# EasyEDA schematic SCH_plantcare_moisture_module_2025-02-19.json
TITLE: Plantcare moisture module; REV: 1.0; Date: 2025-02-15; Sheet: 1/1; Drawn By: arek.stasko; Company: ArkadiuszS
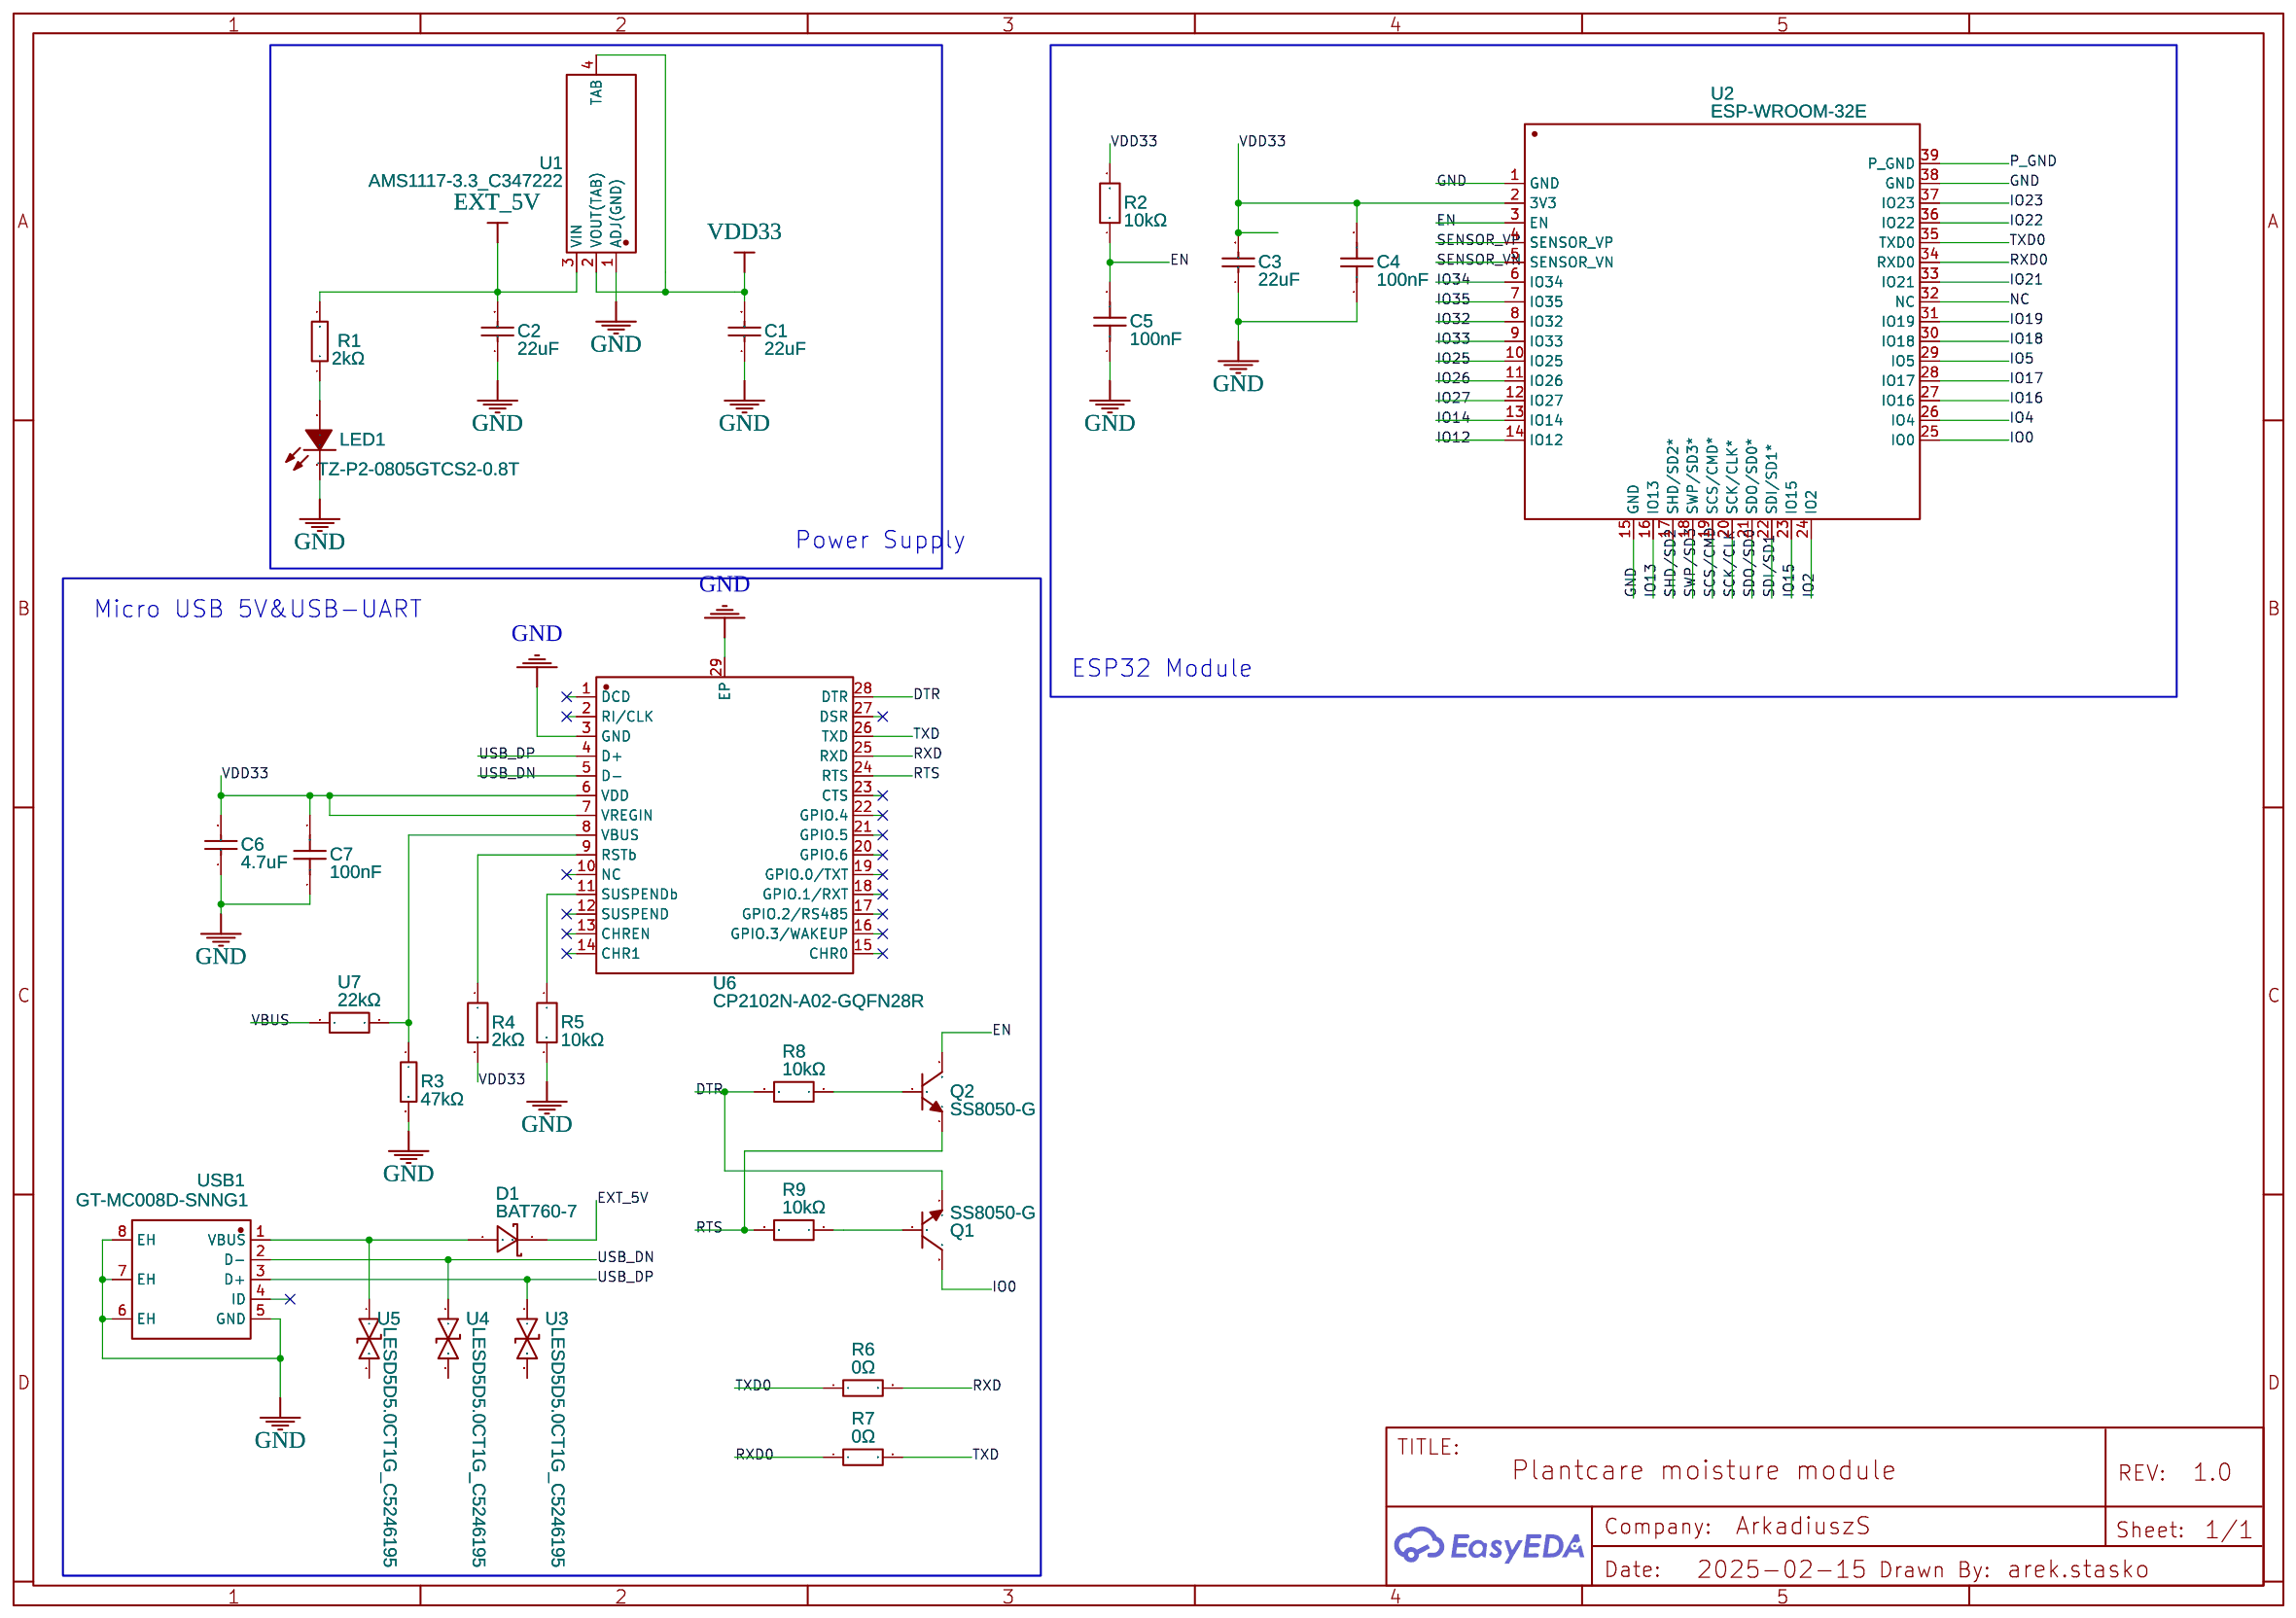
[diagram p0: schematic sheet]

## Parts
C1  22uF  [C0805]
C2  22uF  [C0805]
C3  22uF  [C0805]
C4  100nF  [C0603]
C5  100nF  [C0603]
C6  4.7uF  [C0603]
C7  100nF  [C0603]
D1  BAT760-7  [SOD-323_L1.8-W1.3-LS2.5-RD]
LED1  TZ-P2-0805GTCS2-0.8T  [LED0805-RD_GREEN]
Q1  SS8050-G  [SOT-23-3_L2.9-W1.3-P1.90-LS2.4-BR]
Q2  SS8050-G  [SOT-23-3_L2.9-W1.3-P1.90-LS2.4-BR]
R1  2kΩ  [R0603]
R2  10kΩ  [R0603]
R3  47kΩ  [R0603]
R4  2kΩ  [R0603]
R5  10kΩ  [R0603]
R6  0Ω  [R0603]
R7  0Ω  [R0603]
R8  10kΩ  [R0603]
R9  10kΩ  [R0603]
U1  AMS1117-3.3_C347222  [SOT-223-4_L6.5-W3.5-P2.30-LS7.0-BR]
U2  ESP-WROOM-32E  [COMM-SMD_ESP-WROOM-32D]
U3  LESD5D5.0CT1G_C5246195  [SOD-523_L1.2-W0.8-LS1.6-BI]
U4  LESD5D5.0CT1G_C5246195  [SOD-523_L1.2-W0.8-LS1.6-BI]
U5  LESD5D5.0CT1G_C5246195  [SOD-523_L1.2-W0.8-LS1.6-BI]
U6  CP2102N-A02-GQFN28R  [QFN-28_L5.0-W5.0-P0.50-TL-EP3.3]
U7  22kΩ  [R0603]
USB1  GT-MC008D-SNNG1  [USB-SMD_GT-MC008D-SNNG1]

## Library data of the parts
C1-C3 = CL21A226MPQNNNE: Supplier: LCSC; Manufacturer: SAMSUNG(三星); Supplier Part: C29277; JLCPCB Part Class: Extended Part
C4 C5 = CL10B104KB8NNNC: Supplier: LCSC; Manufacturer: SAMSUNG(三星); Supplier Part: C1591; JLCPCB Part Class: Extended Part
C6 = CL10A475KP8NNNC: Supplier: LCSC; Manufacturer: SAMSUNG(三星); Supplier Part: C1705; JLCPCB Part Class: Extended Part
C7 = CGA0603X7R104K500JT: Supplier: LCSC; Supplier Part: C6119867; Manufacturer: HRE(芯声); JLCPCB Part Class: Extended Part; Contributor: lcsc
D1 = BAT760-7: Contributor: LCSC; Supplier: LCSC; Manufacturer: DIODES(美台); Supplier Part: C124187; JLCPCB Part Class: Extended Part
LED1 = TZ-P2-0805GTCS2-0.8T: Contributor: LCSC; Supplier: LCSC; Supplier Part: C688883; Manufacturer: TUOZHAN(拓展光电); JLCPCB Part Class: Extended Part
Q1 Q2 = SS8050-G: Contributor: LCSC; Supplier: LCSC; Manufacturer: CJ(江苏长电/长晶); Manufacturer Part: SS8050-G(RANGE:120-200); Supplier Part: C164886; JLCPCB Part Class: Extended Part
R1 = 0603WAF2001T5E: Supplier: LCSC; Manufacturer: UNI-ROYAL(厚声); Supplier Part: C22975; JLCPCB Part Class: Basic Part
R2 R5 R8 R9 = FRC0603J103TS: Contributor: LCSC; Supplier: LCSC; Supplier Part: C2930027; Manufacturer: FOJAN(富捷); JLCPCB Part Class: Extended Part
R3 = 0603WAJ0473T5E: Supplier: LCSC; Manufacturer: UNI-ROYAL(厚声); Supplier Part: C25600; JLCPCB Part Class: Extended Part
R4 = FRC0603J202 TS: Contributor: lcsc; Supplier: LCSC; Supplier Part: C2907137; Manufacturer: FOJAN(富捷); JLCPCB Part Class: Extended Part
R6 R7 = 0603WAJ0000T5E: Supplier: LCSC; Manufacturer: UNI-ROYAL(厚声); Supplier Part: C15402; JLCPCB Part Class: Extended Part
U1 = AMS1117-3.3_C347222: Contributor: LCSC; Supplier: LCSC; Supplier Part: C347222; Manufacturer: UMW(友台半导体); Manufacturer Part: AMS1117-3.3; JLCPCB Part Class: Extended Part
U2 = ESP-WROOM-32E: Supplier: LCSC; Supplier Part: C19949066; Manufacturer: DOIT(四博智联); Contributor: lcsc; JLCPCB Part Class: Extended Part
U3-U5 = LESD5D5.0CT1G_C5246195: Contributor: lcsc; Supplier: LCSC; Supplier Part: C5246195; Manufacturer: Leiditech(雷卯电子); Manufacturer Part: LESD5D5.0CT1G; JLCPCB Part Class: Extended Part
U6 = CP2102N-A02-GQFN28R: Contributor: LCSC; Supplier: LCSC; Supplier Part: C964632; Manufacturer: SKYWORKS/SILICON LABS(芯科); JLCPCB Part Class: Extended Part
U7 = FRC0603J223 TS: Supplier: LCSC; Supplier Part: C2907128; Manufacturer: FOJAN(富捷); Contributor: lcsc
USB1 = GT-MC008D-SNNG1: Supplier: LCSC; Supplier Part: C27636757; Manufacturer: G-Switch(品赞); JLCPCB Part Class: Extended Part; Contributor: lcsc

## Nets
GND: C1.1 C2.1 C3.1 C4.1 C5.1 C6.1 C7.1 LED1.1(-) R3.2 R5.2 U1.1(ADJ(GND)) U2.1(GND) U2.15(GND) U2.38(GND) U6.3(GND) U6.29(EP) USB1.5(GND) USB1.6(EH) USB1.7(EH) USB1.8(EH)
VBUS: U7.1
VDD33: C1.2 C3.2 C4.2 C6.2 C7.2 R2.2 R4.2 U1.2(VOUT(TAB)) U1.4(TAB) U2.2(3V3) U6.6(VDD) U6.7(VREGIN)
DTR: Q1.2(E) R8.2 U6.28(DTR)
EN: C5.2 Q2.3(C) R2.1 U2.3(EN)
EXT_5V: C2.2 D1.1 R1.2 U1.3(VIN)
IO0: Q1.3(C) U2.25(IO0)
IO2: U2.24(IO2)
IO4: U2.26(IO4)
IO5: U2.29(IO5)
IO12: U2.14(IO12)
IO13: U2.16(IO13)
IO14: U2.13(IO14)
IO15: U2.23(IO15)
IO16: U2.27(IO16)
IO17: U2.28(IO17)
IO18: U2.30(IO18)
IO19: U2.31(IO19)
IO21: U2.33(IO21)
IO22: U2.36(IO22)
IO23: U2.37(IO23)
IO25: U2.10(IO25)
IO26: U2.11(IO26)
IO27: U2.12(IO27)
IO32: U2.8(IO32)
IO33: U2.9(IO33)
IO34: U2.6(IO34)
IO35: U2.7(IO35)
NC: U2.32(NC)
P_GND: U2.39(P_GND)
RTS: Q2.2(E) R9.2 U6.24(RTS)
RXD: R6.2 U6.25(RXD)
RXD0: R7.1 U2.34(RXD0)
SCK/CLK: U2.20(SCK/CLK*)
SCS/CMD: U2.19(SCS/CMD*)
SDI/SD1: U2.22(SDI/SD1*)
SDO/SD0: U2.21(SDO/SD0*)
SENSOR_VN: U2.5(SENSOR_VN)
SENSOR_VP: U2.4(SENSOR_VP)
SHD/SD2: U2.17(SHD/SD2*)
SWP/SD3: U2.18(SWP/SD3*)
TXD: R7.2 U6.26(TXD)
TXD0: R6.1 U2.35(TXD0)
USB_DN: U4.1 U6.5(D-) USB1.2(D-)
USB_DP: U3.1 U6.4(D+) USB1.3(D+)
Net-(D1-2): D1.2 U5.1 USB1.1(VBUS)
Net-(LED1-2): LED1.2(+) R1.1
Net-(Q1-1): Q1.1(B) R9.1
Net-(Q2-1): Q2.1(B) R8.1
Net-(R3-1): R3.1 U6.8(VBUS) U7.2
Net-(R4-1): R4.1 U6.9(RSTb)
Net-(R5-1): R5.1 U6.11(SUSPENDb)

Not connected (* = marked no-connect by the designer): U3 2; U4 2; U5 2; U6 1(DCD) 2(RI/CLK) 10(NC) 12(SUSPEND) 13(CHREN) 14(CHR1) 15(CHR0) 16(GPIO.3/WAKEUP) 17(GPIO.2/RS485) 18(GPIO.1/RXT) 19(GPIO.0/TXT) 20(GPIO.6) 21(GPIO.5) 22(GPIO.4) 23(CTS) 27(DSR); USB1 4(ID)

## Notes on the sheet
- Power Supply
- Micro USB 5V&USB-UART
- ESP32 Module
